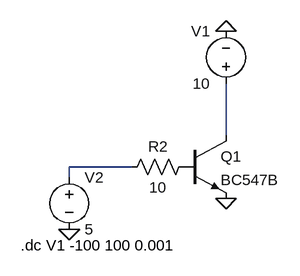
[diagram p0: schematic Draft4.asc]
Draft4.asc, the LTspice schematic file:
Version 4
SHEET 1 880 680
WIRE 288 176 288 96
WIRE 144 224 48 224
WIRE 48 240 48 224
FLAG 288 272 0
FLAG 288 16 0
FLAG 48 320 0
SYMBOL npn 224 176 R0
SYMATTR InstName Q1
SYMATTR Value BC547B
SYMBOL voltage 288 112 R180
WINDOW 0 24 96 Left 2
WINDOW 3 24 16 Left 2
WINDOW 123 0 0 Left 0
WINDOW 39 0 0 Left 0
SYMATTR InstName V1
SYMATTR Value 10
SYMBOL voltage 48 224 R0
WINDOW 123 0 0 Left 0
WINDOW 39 0 0 Left 0
SYMATTR InstName V2
SYMATTR Value 5
SYMBOL res 240 208 R90
WINDOW 0 0 56 VBottom 2
WINDOW 3 32 56 VTop 2
SYMATTR InstName R2
SYMATTR Value 10
TEXT -26 344 Left 2 !.dc V1 -100 100 0.001

The netlist it stands for:
* Draft4.asc
Q1 N001 P001 0 0 BC547B
V1 N001 0 10
V2 N002 0 5
R2 P001 N002 10
.model NPN NPN
.model PNP PNP
.lib standard.bjt
.dc V1 -100 100 0.001
.backanno
.end